# EAGLE design 3PDT_2FX (EAGLE 9.6.2)
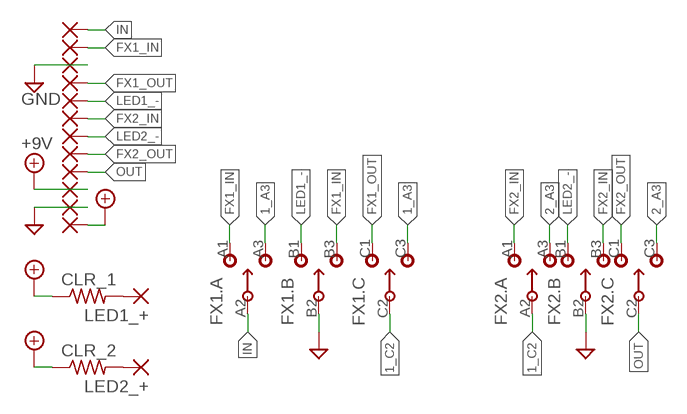
[diagram p0: schematic, sheet 1]

## Parts
+9V  1,6/0,8  [1,6/0,8]
+9V1  1,6/0,8  [1,6/0,8]
CLR_1  R-US_R0603  [R0603]
CLR_2  R-US_R0603  [R0603]
FX1  3PDT.LUGS  [3PDT.LUGS]
FX1_IN  1,6/0,8  [1,6/0,8]
FX1_OUT  1,6/0,8  [1,6/0,8]
FX2  3PDT.LUGS  [3PDT.LUGS]
FX2_IN  1,6/0,8  [1,6/0,8]
FX2_OUT  1,6/0,8  [1,6/0,8]
GND  1,6/0,8  [1,6/0,8]
IN  1,6/0,8  [1,6/0,8]
LED1_+  1,6/0,8  [1,6/0,8]
LED1_-  1,6/0,8  [1,6/0,8]
LED2_+  1,6/0,8  [1,6/0,8]
LED2_-  1,6/0,8  [1,6/0,8]
OUT  1,6/0,8  [1,6/0,8]
PAD3  1,6/0,8  [1,6/0,8]

## Nets
1_A3: FX1.A3 FX1.C3
1_C2: FX1.C2 FX2.A2
2_A3: FX2.A3 FX2.C3
+9V: +9V1.1(P) +9V.1(P) CLR_1.1 CLR_2.1
FX1_IN: FX1.A1 FX1.B3 FX1_IN.1(P)
FX1_OUT: FX1.C1 FX1_OUT.1(P)
FX2_IN: FX2.A1 FX2.B3 FX2_IN.1(P)
FX2_OUT: FX2.C1 FX2_OUT.1(P)
GND: FX1.B2 FX2.B2 GND.1(P) PAD3.1(P)
IN: FX1.A2 IN.1(P)
LED1_-: FX1.B1 LED1_-.1(P)
LED2_-: FX2.B1 LED2_-.1(P)
N$1: CLR_1.2 LED1_+.1(P)
N$2: CLR_2.2 LED2_+.1(P)
OUT: FX2.C2 OUT.1(P)

## Library data of the parts
+9V +9V1 FX1_IN FX1_OUT FX2_IN FX2_OUT GND IN LED1_+ LED1_- LED2_+ LED2_- OUT PAD3 = wirepad:1,6/0,8: THROUGH-HOLE PAD
CLR_1 CLR_2 = adafruit:R-US_: RESISTOR, American symbol
FX1 FX2 = switches:3PDT: 3PDT Switches

## Board
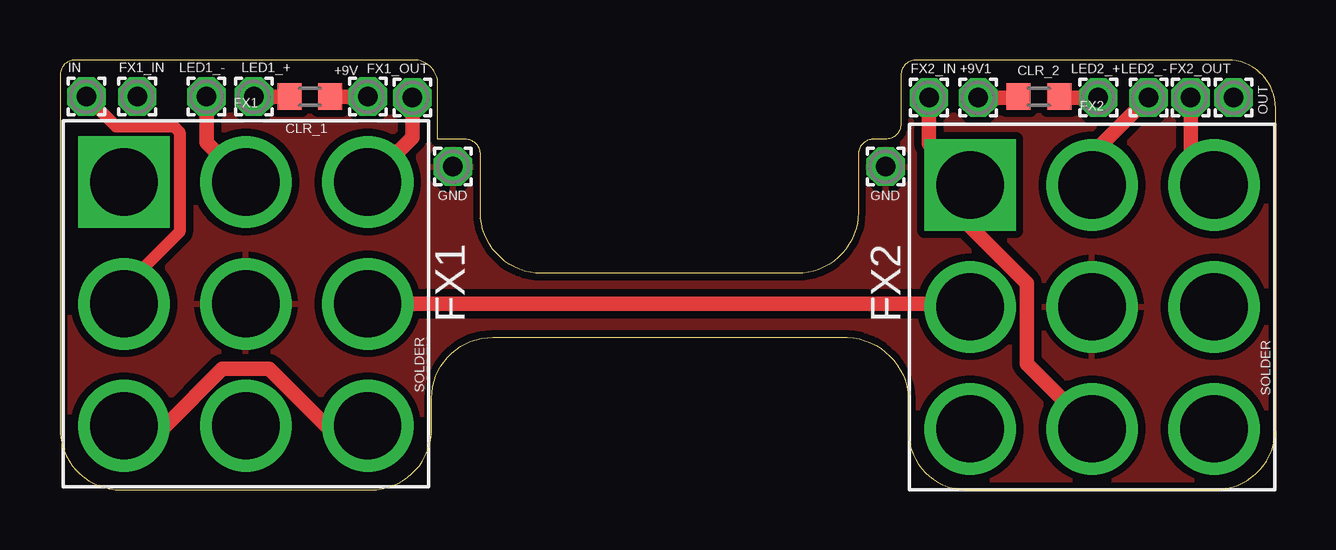
[diagram p1: board, top side]
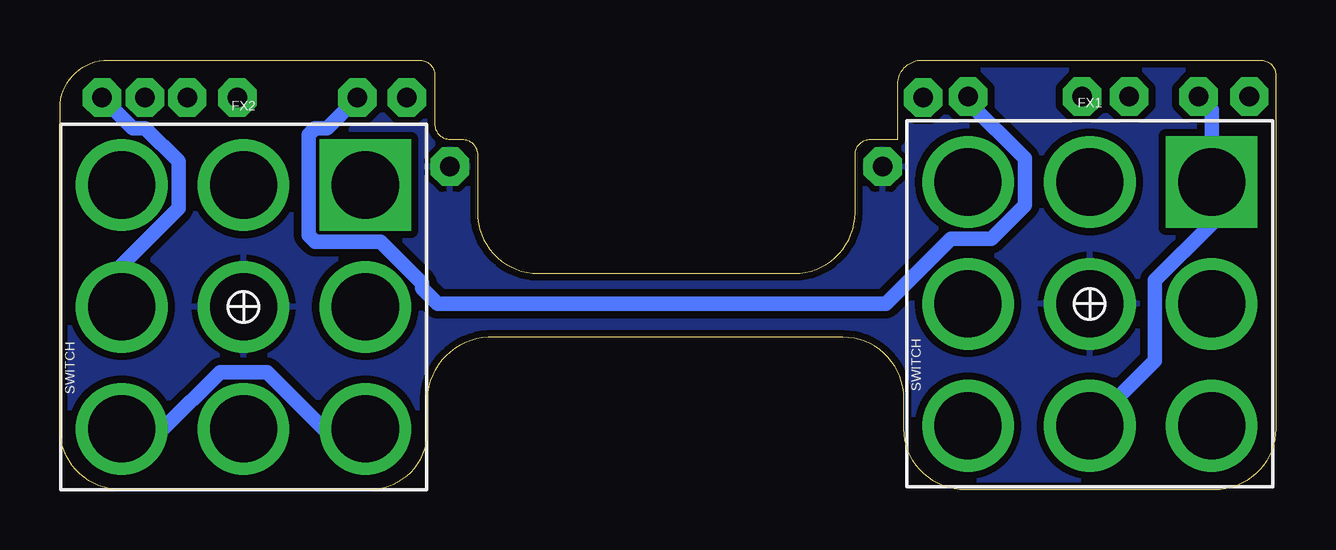
[diagram p2: board, bottom side, seen from below]

Size 50.67 x 17.91 mm. Coordinates in mm from the lower left corner, seen from the top.
Outline: 15.75,14.61 15.75,16.91 arc90 14.75,17.91 0.64,17.91 arc90 0,17.27 0,2.54 arc90 2.54,0 12.95,0 arc90 15.49,2.54 15.49,3.81 arc-90 18.03,6.35 32.58,6.35 arc-90 35.37,3.81 35.37,2.54 arc90 37.66,0 48.13,0 arc90 50.67,2.54 50.67,15.91 arc90 48.67,17.91 35.69,17.91 arc90 35.05,17.27 35.05,15.24 arc-90 34.42,14.61 33.91,14.61 arc90 33.27,13.97 33.27,11.56 arc-90 30.73,9.02 20.07,9.02 arc-90 17.53,11.56 17.53,13.97 arc90 16.89,14.61 15.75,14.61
Copper layers (1*16): Top 0.035mm / dielectric 1.5mm / Bottom 0.035mm
Design rules "default *": minimum track width 6mil, minimum drill 0.35mm, track to track 6mil, track to pad 6mil, pad to pad 6mil, via to via 6mil, smd to smd 6mil, copper to edge 10mil, drill to drill 6mil, minimum pad ring 10mil, minimum via ring 8mil, stop-mask expansion 4mil, vias tented up to drill 0mil, thermal gap 10mil

### Footprints (pad centres in the part's own frame; a part is rotated, then mirrored left to right if it is on the bottom)
1,6/0,8 = drill 0.813 pad 1.6 octagon: 1 0,0
R0603 = smd 1 x 1.1: 1 -0.85,0; 2 0.85,0
3PDT.LUGS = drill 2.8 square: A1 -5.08,5.08 | drill 2.8: A2 -5.08,0; A3 -5.08,-5.08; B1 0,5.08; B2 0,0; B3 0,-5.08; C1 5.08,5.08; C2 5.08,0; C3 5.08,-5.08

### Placement (x,y rotation side)
+9V  12.83,16.38 0 top
+9V1  38.27,16.34 0 top
CLR_1  10.41,16.38 180 top
CLR_2  40.8,16.38 0 top
FX1  7.75,7.75 0 top
FX1_IN  3.22,16.38 0 top
FX1_OUT  14.69,16.34 0 top
FX2  43.02,7.62 0 top
FX2_IN  36.22,16.34 0 top
FX2_OUT  47.13,16.34 0 top
GND  16.38,13.46 0 top
IN  1.1,16.38 0 top
LED1_+  8.07,16.38 0 top
LED1_-  6.11,16.38 0 top
LED2_+  43.28,16.34 0 top
LED2_-  45.37,16.34 0 top
OUT  48.92,16.34 0 top
PAD3  34.42,13.46 0 top

### Tracks (layer width: path | path; a pad name or v marks a point on that pad's centre or on a via)
1_A3
  Top 0.61: FX1.A3 4.4,2.67 6.77,5.03 8.73,5.03 11.09,2.67 FX1.C3
1_C2
  Top 0.61: FX1.C2 37.81,7.75 FX2.A2
2_A3
  Bottom 0.61: FX2.A3 39.67,2.54 42.04,4.91 44,4.91 46.37,2.54 FX2.C3
+9V
  Top 0.61: CLR_1.1 +9V.1 | +9V1.1 39.91,16.34 CLR_2.1
  Bottom 0.61: +9V.1 12.83,16.17 10.46,13.81 10.46,11.85 11.85,10.46 13.54,10.46 16.26,7.75 34.92,7.75 35.58,8.4 35.58,8.6 37.31,10.34 40.04,10.34 40.3,10.6 40.3,14.8 40.04,15.06 39.55,15.06 +9V1.1
FX1_IN
  Bottom 0.61: FX1.B3 5.03,5.38 5.03,8.73 2.67,11.09 FX1.A1 2.67,15.83 FX1_IN.1
FX1_OUT
  Top 0.61: FX1.C1 14.69,14.69 FX1_OUT.1
FX2_IN
  Top 0.61: FX2_IN.1 36.22,14.42 FX2.A1 37.94,10.96 40.3,8.6 40.3,5.25 FX2.B3
FX2_OUT
  Top 0.61: FX2_OUT.1 47.13,13.67 FX2.C1
GND
  pour Bottom (isolate 0.305): -2,20 -2,-2 52,-2 52,19 -1,19
  pour Top (isolate 0.305): -2,20 -2,-2 52,-2 52,19 51,20
IN
  Top 0.508: IN.1 2.34,15.14 4.74,15.14 4.98,14.9 4.98,10.75 2.67,8.44 FX1.A2
LED1_-
  Top 0.61: LED1_-.1 6.11,14.47 FX1.B1
LED2_-
  Top 0.61: LED2_-.1 43.02,13.99 FX2.B1
N$1
  Top 0.61: LED1_+.1 CLR_1.2
N$2
  Top 0.61: CLR_2.2 41.7,16.34 LED2_+.1
OUT
  Bottom 0.61: FX2.C2 48.1,9.36 45.73,11.72 45.73,13.68 47.12,15.06 47.65,15.06 OUT.1

### Text on the board
tPlace: GND | FX1 | FX2